# Altium schematic sheet ads1191 SCH.SchDoc
size A4
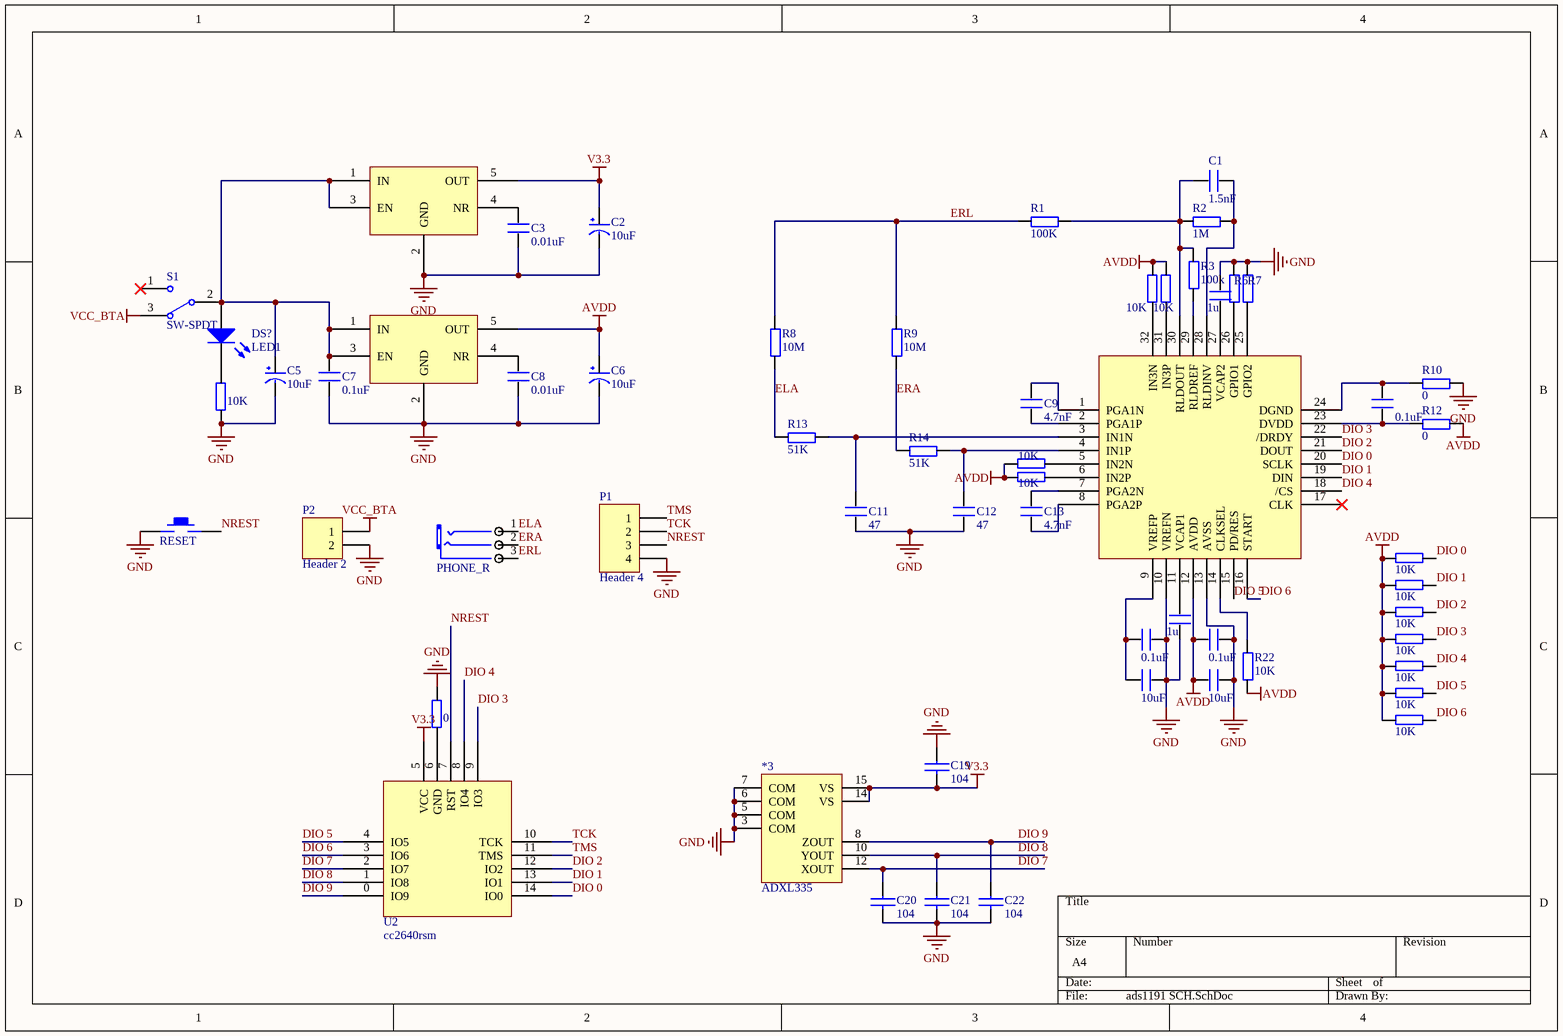
[diagram p0: ads1191 SCH.SchDoc]

## Parts
*1  TPS73033  [SOT 23 5]  (value not drawn)
*2  TPS73033  [SOT 23 5]  (value not drawn)
*3  ADXL335  [Quad16]
C1  1.5nF  [0603P]
C2  10uF  [1206钽电容]
C3  0.01uF  [0603P]
C4  1u  [0603P]
C5  10uF  [1206钽电容]
C6  10uF  [1206钽电容]
C7  0.1uF  [0603P]
C8  0.01uF  [0603P]
C9  4.7nF  [0603P]
C10  0.1uF  [0603P]
C11  47  [0603P]
C12  47  [0603P]
C13  4.7nF  [0603P]
C14  0.1uF  [0603P]
C15  1u  [0603P]
C16  0.1uF  [0603P]
C17  10uF  [0603P]
C18  10uF  [0603P]
C19  104  [0603P]
C20  104  [0603P]
C21  104  [0603P]
C22  104  [0603P]
DS?  LED1  [SMDLED]
ER1  PHONE_R  [PHONE_ST]
P1  Header 4  [HDR1X4]
P2  Header 2  [HDR1X2]
R1  100K  [0603P]
R2  1M  [0603P]
R3  100k  [0603P]
R4  10K  [0603P]
R5  10K  [0603P]
R6  10K  [0603P]  (value not drawn)
R7  10K  [0603P]  (value not drawn)
R8  10M  [0603P]
R9  10M  [0603P]
R10  0  [0603P]
R11  10K  [0603P]
R12  0  [0603P]
R13  51K  [0603P]
R14  51K  [0603P]
R15  10K  [0603P]
R16  10K  [0603P]
R17  10K  [0603P]
R18  10K  [0603P]
R19  10K  [0603P]
R20  10K  [0603P]
R21  10K  [0603P]
R22  10K  [0603P]
R23  10K  [0603P]
R24  0  [0603P]
R25  10K  [0603P]
RESET  KEY_M  [SW-2]  (value not drawn)
S1  SW-SPDT  [ss12]
U1  U?  [Quad32]  (value not drawn)
U2  cc2640rsm  [CC2640RSM]

## Nets
AVDD: *2.5(OUT) C6.1(VCC) C16.2 C18.2 R4.1 R5.1 R12.2 R15.2 R16.2 R17.2 R18.2 R19.2 R20.2 R21.2 R22.1 R23.2 R25.2 U1.12(AVDD)
GND: *1.2(GND) *2.2(GND) *3.3(COM) *3.5(COM) *3.6(COM) *3.7(COM) C2.2(GND) C3.1 C4.2 C5.2(GND) C6.2(GND) C7.1 C8.1 C11.1 C12.1 C14.1 C15.1 C16.1 C17.1 C18.1 C19.1 C20.2 C21.2 C22.2 P1.4 P2.2 R6.2 R7.2 R10.2 R11.2 R24.1 RESET.1 U1.10(VREFN) U1.13(AVSS)
V3.3: *1.5(OUT) *3.14(VS) *3.15(VS) C2.1(VCC) C19.2 U2.5(VCC)
VCC_BTA: P2.1 S1.3
DIO 0: R17.1 U1.20(SCLK) U2.14(IO0)
DIO 1: R18.1 U1.19(DIN) U2.13(IO1)
DIO 2: R19.1 U1.21(DOUT) U2.12(IO2)
DIO 3: R20.1 U1.22(/DRDY) U2.9(IO3)
DIO 4: R21.1 U1.18(/CS) U2.8(IO4)
DIO 5: R23.1 U1.15(PD/RES) U2.4(IO5)
DIO 6: R25.1 U1.16(START) U2.3(IO6)
DIO 7: *3.12(XOUT) C20.1 U2.2(IO7)
DIO 8: *3.10(YOUT) C21.1 U2.1(IO8)
DIO 9: *3.8(ZOUT) C22.1 U2.0(IO9)
ELA: ER1.1(CHL) R8.1 R13.1
ERA: ER1.2(CHR) R9.1 R14.1
ERL: ER1.3(COM) R1.1 R8.2 R9.2
NREST: P1.3 RESET.2 U2.7(RST)
TCK: P1.2 U2.10(TCK)
TMS: P1.1 U2.11(TMS)
Net*1_1: *1.1(IN) *1.3(EN) *2.1(IN) *2.3(EN) C5.1(VCC) C7.2 DS?.1(A) S1.2
Net*1_4: *1.4(NR) C3.2
Net*2_4: *2.4(NR) C8.2
NetC1_1: C1.1 R2.2 U1.28(RLDINV)
NetC1_2: C1.2 R1.2 R2.1 R3.2 U1.30(RLDOUT)
NetC4_1: C4.1 U1.27(VCAP2)
NetC9_1: C9.1 U1.2(PGA1P)
NetC9_2: C9.2 U1.1(PGA1N)
NetC10_1: C10.1 R10.1 U1.24(DGND)
NetC10_2: C10.2 R12.1 U1.23(DVDD)
NetC11_2: C11.2 R13.2 U1.3(IN1N)
NetC12_2: C12.2 R14.2 U1.4(IN1P)
NetC13_1: C13.1 U1.8(PGA2P)
NetC13_2: C13.2 U1.7(PGA2N)
NetC14_2: C14.2 C17.2 U1.9(VREFP)
NetC15_2: C15.2 U1.11(VCAP1)
NetDS?_2: DS?.2(K) R11.1
NetR3_1: R3.1 U1.29(RLDREF)
NetR4_2: R4.2 U1.32(IN3N)
NetR5_2: R5.2 U1.31(IN3P)
NetR6_1: R6.1 U1.26(GPIO1)
NetR7_1: R7.1 U1.25(GPIO2)
NetR15_1: R15.1 U1.5(IN2N)
NetR16_1: R16.1 U1.6(IN2P)
NetR22_2: R22.2 U1.14(CLKSEL)
NetR24_2: R24.2 U2.6(GND)

Not connected (* = marked no-connect by the designer): S1 1*; U1 17(CLK)*

## Library data of the parts
C1 C3 C4 C7-C18 = C
C2 C5 C6 = CAP
C19-C22 = C: Text Field1: 20; Text Field2: 10
DS? = LED2: Typical RED, GREEN, YELLOW, AMBER GaAs LED; Published: 8-Jun-2000; LatestRevisionDate: 17-Jul-2002; LatestRevisionNote: Re-released for DXP Platform.; PackageDocument: Feb-2002; PackageReference: 3.2X1.6X1.1; Publisher: Altium Limited
ER1 = PHONE_M
P1 = Header 4: Header, 4-Pin; LatestRevisionDate: 17-Jul-2002; LatestRevisionNote: Re-released for DXP Platform.; Publisher: Altium Limited
P2 = Header 2: Header, 2-Pin; LatestRevisionDate: 17-Jul-2002; LatestRevisionNote: Re-released for DXP Platform.; Publisher: Altium Limited
R1-R25 = R
S1 = SW-SPDT: SPDT Subminiature Toggle Switch, Right Angle Mounting, Vertical Actuation; Published: 24-Mar-1999; LatestRevisionDate: 17-Dec-2003; LatestRevisionNote: Schematic revised, PCB Footprint replaced.; DatasheetVersion: 05-Dec-2000; PackageReference: TL36WW15050; Publisher: Altium Limited; PackageDescription: Switch; 4 Leads; ComponentLink1Description: Manufacturer Link; ComponentLink1URL: http://www.apem.com
U1 = ADS1191